# Altium schematic sheet Power.SchDoc
size A; SheetNumber: 2; SheetTotal: 4
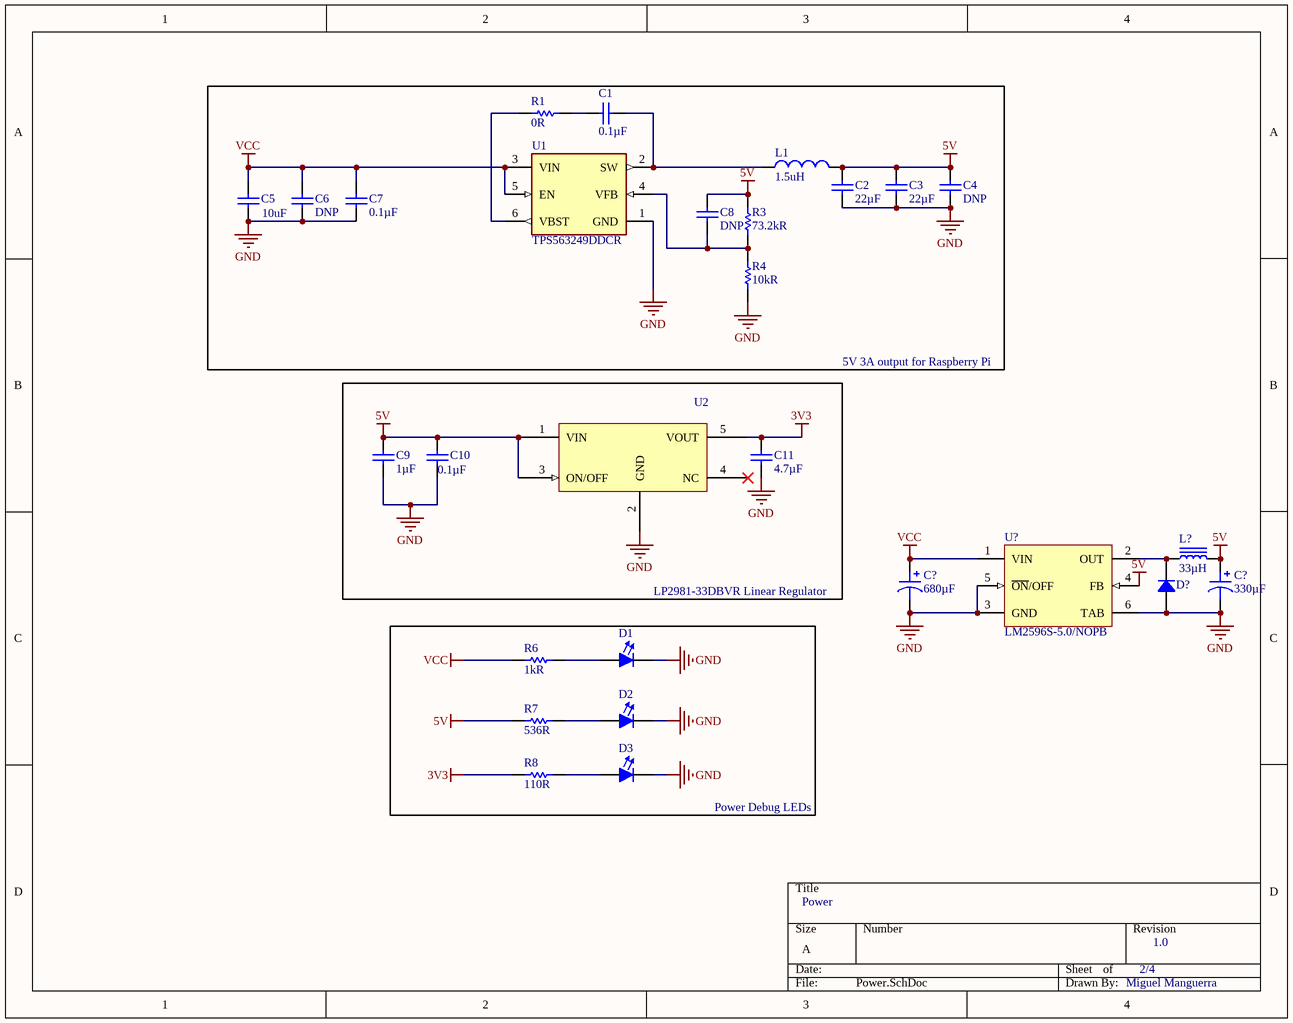
[diagram p0: Power.SchDoc]

## Parts
(Parts that share a designator on the sheet are numbered #1, #2 ... from top to bottom, then left to right.)
C1  Capacitance: 0.1µF  [CAPC1608N(0603")]  (hidden comment: 0.1uF, 50V, 10%, X7R, 0603)
C2  value 22µF  [CAPC2012N(0805")]  (hidden comment: 22uF 35V 0805 SMD, Ceramic)
C3  value 22µF  [CAPC2012N(0805")]  (hidden comment: 22uF 35V 0805 SMD, Ceramic)
C4  value DNP  [CAPC1608N(0603")]  (hidden comment: Placeholder_Capacitor_0603)
C5  Capacitance: 10uF  [CAPC2013X12N]  (hidden comment: 10uF, 25V, X5R, 0805)
C6  value DNP  [CAPC3216N(1206")]  (hidden comment: Placeholder_Capacitor_1206)
C7  Capacitance: 0.1µF  [CAPC1608N(0603")]  (hidden comment: 0.1uF, 50V, 10%, X7R, 0603)
C8  value DNP  [CAPC1608N(0603")]  (hidden comment: Placeholder_Capacitor_0603)
C9  value 1µF  [CAPC1608N(0603")]  (hidden comment: 1uF 25V 0603 SMD, Ceramic)
C10  value 0.1µF  [CAPC1608N(0603")]  (hidden comment: 0.1uF 16V 0603 SMD, Ceramic)
C11  value 4.7µF  [CAPC1608N(0603")]  (hidden comment: 4.7uF 10V 0603 SMD, Ceramic)
C?#1  680µF  [CAP ALSMD 8.3MM H10.5MM]
C?#2  330µF  [CAP ALSMD 8.3MM H10.5MM]
D1  LT Q39G-Q1OO-25-1  [FP-LB_Q39E-MFG]  (value not drawn)
D2  LT Q39G-Q1OO-25-1  [FP-LB_Q39E-MFG]  (value not drawn)
D3  LT Q39G-Q1OO-25-1  [FP-LB_Q39E-MFG]  (value not drawn)
D?  MBRS360BT3G  [DO214AA SMB]  (value not drawn)
L1  Inductance: 1.5uH  [INDC2520X12N]  (hidden comment: DFE252012P-1R5M=P2)
L?  33µH  [BOURNS SRR1280]
R1  value 0R  [RESC1608N(0603")]  (hidden comment: 0R, 1%, 1/10W, 0603 SMD)
R3  Resistance: 73.2kR  [RESC1608X55X30LL15T15]  (hidden comment: ERJ-3EKF7322V)
R4  Resistance: 10kR  [RESC1608X55X25ML10T15]  (hidden comment: RC0603FR-0710KL)
R6  Resistance: 1kR  [RESC1608X55X30ML15T15]  (hidden comment: ERJ3EKF1001V)
R7  536R  [RESC1608X55X30ML15T15]
R8  110R  [RESC1608X55X25ML10T15]
U1  TPS563249DDCR  [FP-DDC0005A-IPC_B]
U2  LP2981-33DBVR  [SOT95P280X145-5N]  (value not drawn)
U?  LM2596S-5.0/NOPB  [KTT0005B_M]

## Blocks framed on the sheet
5V 3A output for Raspberry Pi: C1-C8 L1 R1 R3 R4 U1

## Nets
3V3: C11.2(Cathode) R8.1 U2.5(VOUT)
5V: C2.2(Cathode) C3.2(Cathode) C4.2(Cathode) C8.2(Cathode) C9.2(Cathode) C10.2(Cathode) C?#2.1 L1.2 L?.2 R3.2 R7.1 U2.1(VIN) U2.3(ON/OFF) U?.4(FB)
GND: C2.1(Anode) C3.1(Anode) C4.1(Anode) C5.2 C6.1(Anode) C7.1(Anode) C9.1(Anode) C10.1(Anode) C11.1(Anode) C?#1.2 C?#2.2 D1.1(Cathode) D2.1(Cathode) D3.1(Cathode) D?.1 R4.1 U1.1(GND) U2.2(GND) U?.3(GND) U?.5(~{ON}/OFF) U?.6(TAB)
VCC: C5.1 C6.2(Cathode) C7.2(Cathode) C?#1.1 R6.1 U1.3(VIN) U1.5(EN) U?.1(VIN)
NetC1_1: C1.1(Anode) L1.1 U1.2(SW)
NetC1_2: C1.2(Cathode) R1.2
NetC8_1: C8.1(Anode) R3.1 R4.2 U1.4(VFB)
NetD1_2: D1.2(Anode) R6.2
NetD2_2: D2.2(Anode) R7.2
NetD3_2: D3.2(Anode) R8.2
NetD?_2: D?.2 L?.1 U?.2(OUT)
NetR1_1: R1.1 U1.6(VBST)

Not connected (* = marked no-connect by the designer): U2 4(NC)*

## Notes on the sheet
- LP2981-33DBVR Linear Regulator
- Power Debug LEDs
- Power
- 2/4
- 1.0
- Miguel Manguerra

## Library data of the parts
C1 C7 = CMP-006-0007-1: 0.1µF ±10% Ceramic Capacitor X7R 0603 (1608 Metric); Operating Temperature: -55°C ~ 125°C; Pin Count: 2; Design Item ID: 0.1uF, 50V, 10%, X7R, 0603; Package / Case: 0603 (1608 Metric); Source: AUVic_Schematic_Library_Capacitors.SchLib; ComponentLink1URL: https://www.digikey.ca/product-detail/en/tdk-corporation/C1608X7R1H104M080AA/445-5098-1-ND/2093713; ComponentLink1Description: Digi-Key; Mounting Type: Surface Mount, MLCC; Component Type: Standard; Created By: Poorna Chander Kalidas
C2 C3 = CMP-006-0036-1: Capacitor, Ceramic, 35V, +/- 20%, 0805 SMD, X5R; Design Item ID: 22uF 35V 0805 SMD, Ceramic; Source: AUVic_Schematic_Library_Capacitors.SchLib; Pin Count: 2; Component Type: Standard; Publisher: AUVic; PackageDescription: Chip Capacitor; Published: 14-06-01
C4 C8 = CMP-006-0054-1: Placeholder 0603 SMT Footprint; Made By: Ashwin Sira; Date Created: 2016-06-26; Design Item ID: Placeholder_Capacitor_0603; PackageDescription: Chip Capacitor; Component Type: Standard (No BOM); Pin Count: 2; Source: AUVic_Schematic_Library_Capacitors.SchLib; Publisher: AUVic
C5 = CMP-00114-1: 0805 10 uF 25 V ±10% Tolerance X5R SMT Multilayer Ceramic Capacitor; Dielectric: X7R; Max Operating Temperature: 85°C; Resistor Type: Ceramic; Lead Free: Lead Free; Tolerance: 10%; Height: 1.25mm; Package Quantity: 1; Voltage Rating: 25V; Width: 0.049inch; Min Operating Temperature: -55°C; Case Code (Imperial): 0805; Number of Pins: 2; Thickness: 0.053inch; Length: 0.079inch; Case Code (Metric): 2012; Mount: Surface Mount; Case/Package: 0805; Packaging: Tape and Reel; REACH SVHC: No SVHC; Termination: SMD/SMT; Voltage Rating (DC): 25V
C6 = CMP-006-0056-1: Placeholder 1206 SMT Footprint; Made By: Ashwin Sira; PackageDescription: Chip Capacitor; Component Type: Standard (No BOM); Source: AUVic_Schematic_Library_Capacitors.SchLib; Date Created: 2016-06-26; Design Item ID: Placeholder_Capacitor_1206; Pin Count: 2; Publisher: AUVic
C9 = CMP-006-0027-1: Capacitor, Ceramic, 25V, +/- 10%, 0603 SMD, X5R; MFG: Murata-Electronics-North-America; MFG#: GRM188R61E105KA12D; Created By: Andy Bates; Publisher: AUVic; Source: AUVic_Schematic_Library_Capacitors.SchLib; Component Type: Standard; Pin Count: 2; PackageDescription: Chip Capacitor; Design Item ID: 1uF 25V 0603 SMD, Ceramic; Published: 16-06-27
C10 = CMP-006-0005-1: Capacitor, Ceramic, 16V, +/- 10%, 0603 SMD, X7R; Created By: Andy Bates; Published: 16-04-26; PackageDescription: Chip Capacitor; Pin Count: 2; Source: AUVic_Schematic_Library_Capacitors.SchLib; Design Item ID: 0.1uF 16V 0603 SMD, Ceramic; Component Type: Standard; Publisher: AUVic
C11 = CMP-006-0043-1: Capacitor, Ceramic, 10V, +/- 10%, 0603 SMD, X5R; MFG: Samsung; MFG#: GRM188R61A475KE15D; PackageDescription: Chip Capacitor; Source: AUVic_Schematic_Library_Capacitors.SchLib; Published: 16-06-23; Created By: Ashwin Sira; Component Type: Standard; Pin Count: 2; Publisher: AUVic; Design Item ID: 4.7uF 10V 0603 SMD, Ceramic
C?#1 = EMZR160ARA681MHA0G: CAP ALUM 680UF 20% 16V SMD; Manufacturer: United Chemi-Con; ESR (Equivalent Series Resistance): 80mOhm @ 100kHz; Lifetime @ Temp.: 2000 Hrs @ 105°C; Polarization: Polar; Ripple Current @ High Frequency: 850mA @ 100kHz; Ripple Current @ Low Frequency: 510mA @ 120Hz; Surface Mount Land Size: 0.327" L x 0.327" W (8.30mm x 8.30mm); Part Number: EMZR160ARA681MHA0G; Applications: Automotive; Capacitance: 680µF; ComponentLink1Description: Datasheet; ComponentLink1URL: http://www.chemi-con.co.jp/cgi-bin/CAT_DB/SEARCH/cat_db_al.cgi?e=e&j=p&pdfname=mzr; ComponentLink2Description: DigiKey Link; ComponentLink2URL: http://digikey.com/product-detail/en/united-chemi-con/EMZR160ARA681MHA0G/565-5139-1-ND/8637134; Device Package: Radial, Can - SMD; Height - Seated (Max): 0.413" (10.50mm); LastUpdated: 9/2/2020 1:25:13 AM; Lifecycle Status: Active; Minimum Order: 1; Mounting Type: Surface Mount; Operating Temperature: -55°C ~ 105°C; Package / Case: Radial, Can - SMD; Packaging: TapeAndReel; PartId: 7809; Part Status: Active; Price: 0.33; Ratings: AEC-Q200; Series: Alchip™- MZR; Size / Dimension: 0.315" Dia (8.00mm); Supplier 1: DigiKey; Supplier Part Number 1: 565-5139-1-ND; Tolerance: ±20%; Value: 680µF; Voltage - Rated: 16V
C?#2 = UUR1E331MNL6GS: CAP ALUM 330UF 20% 25V SMD; Manufacturer: Nichicon; Lifetime @ Temp.: 2000 Hrs @ 85°C; Ripple Current @ High Frequency: 369.2mA @ 10kHz; Ripple Current @ Low Frequency: 284mA @ 120Hz; Surface Mount Land Size: 0.327" L x 0.327" W (8.30mm x 8.30mm); Part Number: UUR1E331MNL6GS; Applications: General Purpose; Capacitance: 330µF; ComponentLink1Description: Datasheet; ComponentLink1URL: http://nichicon-us.com/english/products/pdfs/e-uur.pdf; ComponentLink2Description: DigiKey Link; ComponentLink2URL: http://digikey.com/product-detail/en/nichicon/UUR1E331MNL6GS/493-6224-1-ND/3438737; Device Package: Radial, Can - SMD; Height - Seated (Max): 0.413" (10.50mm); LastUpdated: 9/2/2020 1:25:16 AM; Lifecycle Status: Active; Minimum Order: 1; Mounting Type: Surface Mount; Operating Temperature: -40°C ~ 85°C; Package / Case: Radial, Can - SMD; Packaging: TapeAndReel; PartId: 7472; Part Status: Active; Price: 0.22; Series: UUR; Size / Dimension: 0.315" Dia (8.00mm); Supplier 1: DigiKey; Supplier Part Number 1: 493-6224-1-ND; Tolerance: ±20%; Value: 330µF; Voltage - Rated: 25V
D1-D3 = CMP-00064-3: LED GREEN DIFFUSED 0603 SMD; Dominant Wavelength: 530nm; Luminous Intensity: 280mcd; Lens Style: Diffused,Colorless,Rectangular; Number of LEDs: 1; Forward Voltage: 2.85V; Test Current: 5mA; Reverse Voltage: 5V; Forward Current: 15mA; Luminous Flux: 0.55lm; Radiation Hardening: No; Packaging: Tape and Reel; Mount: Surface Mount; Color: Green; Max Operating Temperature: 85°C; Number of Elements: 1; Number of Pins: 2; Min Operating Temperature: -40°C; Depth: 0.9mm; Case/Package: SMD/SMT; Length: 1.7mm
D? = MBRS360BT3G: DIODE SCHOTTKY 60V 3A SMB; Manufacturer: ON Semiconductor; Current - Reverse Leakage @ Vr: 30µA @ 60V; Speed: Fast Recovery =< 500ns, > 200mA (Io); Voltage - Forward (Vf) (Max) @ If: 630mV @ 3A; Part Number: MBRS360BT3G; ComponentLink1Description: Datasheet; ComponentLink1URL: https://www.onsemi.com/pub/Collateral/MBRS360T3-D.PDF; ComponentLink2Description: DigiKey Link; ComponentLink2URL: http://digikey.com/product-detail/en/on-semiconductor/MBRS360BT3G/MBRS360BT3GOSCT-ND/2623453; Current - Average Rectified (Io): 3A; Diode Type: Schottky; LastUpdated: 9/2/2020 1:18:52 AM; Lifecycle Status: Active; Minimum Order: 1; Mounting Type: Surface Mount; Operating Temperature - Junction: -65°C ~ 175°C; Package / Case: DO-214AA, SMB; Packaging: TapeAndReel; PartId: 1547; Part Status: Active; Price: 0.13; Series: -; Supplier 1: DigiKey; Supplier Part Number 1: MBRS360BT3GOSCT-ND; Supplier Device Package: SMB; Voltage - DC Reverse (Vr) (Max): 60V
L1 = CMP-00112-1: Ind Metal Alloy Shielded 1.5uH 20% 1MHz Powdered Iron 2.6A 1008 T/R; Core Material: Ferrite; Current Rating: 3.5A; DC Resistance (DCR): 60mR; Packaging: Tape and Reel; Mount: Surface Mount; Depth: 2mm; Tolerance: 20%; Shielding: Shielded; Test Frequency: 1MHz; Width: 0.079inch; Case Code (Metric): 2520; Min Operating Temperature: -40°C; Resistor Type: Wirewound,Metal Alloy; Length: 0.098inch; Case/Package: 1008; Case Code (Imperial): 1008; Height - Seated (Max): 0.039inch; Max Operating Temperature: 125°C; Max DC Current: 2.6A
L? = SRR1280-330M: FIXED IND 33UH 3.5A 57 MOHM SMD; Manufacturer: Bourns Inc.; Current - Saturation: 3.3A; DC Resistance (DCR): 57mOhm Max; Frequency - Self Resonant: 9.5MHz; Inductance Frequency - Test: 100kHz; Material - Core: Ferrite; Q @ Freq: 28 @ 2.52MHz; Shielding: Shielded; Tolerance: ±20%; Type: Wirewound; Part Number: SRR1280-330M; ComponentLink1Description: Datasheet; ComponentLink1URL: https://www.bourns.com/docs/Product-Datasheets/SRR1280.pdf; ComponentLink2Description: DigiKey Link; ComponentLink2URL: http://digikey.com/product-detail/en/bourns-inc/SRR1280-330M/SRR1280-330MCT-ND/2127440; Current Rating (Amps): 3.5A; Device Package: Nonstandard; Height - Seated (Max): 0.315" (8.00mm); Inductance: 33µH; LastUpdated: 9/2/2020 1:22:09 AM; Lifecycle Status: Active; Minimum Order: 1; Mounting Type: Surface Mount; Operating Temperature: -40°C ~ 125°C; Package / Case: Nonstandard; Packaging: TapeAndReel; PartId: 25; Part Status: Active; Price: 0.65; Series: SRR1280; Size / Dimension: 0.492" L x 0.492" W (12.50mm x 12.50mm); Supplier 1: DigiKey; Supplier Part Number 1: SRR1280-330MCT-ND; Value: 33µH
R1 = CMP-047-0001-1: Made By: Ashwin Sira; Owned By: AUVic; Component Type: Standard; Design Item ID: 0R, 1%, 1/10W, 0603 SMD; Last Edited: 14-05-31; Created On: 14-05-31; Source: AUVic_Schematic_Library_Resistors.SchLib; Pin Count: 2
R3 = CMP-00029-1: Res Thick Film 0603 73.2K Ohm 1% 0.1W(1/10W) ±100ppm/C Pad SMD Automotive T/R; Max Power Dissipation: 100mW; Voltage Rating (DC): 50V; Temperature Coefficient: 100ppm/°C; Voltage Rating: 75V; Packaging: Tape and Reel; REACH SVHC: No SVHC; Case Code (Imperial): 0603; Mount: Surface Mount; Height: 0.022inch; Military Standard: Not; Features: Automotive AEC-Q200; Power Rating: 100mW; Width: 0.031inch; Termination: SMD/SMT; Number of Terminations: 2; Composition: Thick Film; Length: 1.6mm; Depth: 0.8mm; Min Operating Temperature: -55°C; Package Quantity: 1; Max Operating Temperature: 155°C; Case/Package: 0603; Case Code (Metric): 1608; Tolerance: 1%; Radiation Hardening: No; Contact Plating: Tin; Lead Free: Lead Free
R4 = CMP-00037-1: Res General Purpose Thick Film 0603 10K Ohm 1% 1/10W ±100ppm/°C Molded SMD Paper T/R; Power Rating: 100mW; Voltage Rating (DC): 50V; Voltage Rating: 75V; Case/Package: 0603; Weight: 7.1E-05oz; Case Code (Imperial): 0603; Composition: Thick Film; Depth: 0.8mm; Min Operating Temperature: -55°C; Width: 0.8mm; Height: 0.45mm; Military Standard: Not; Packaging: Tape and Reel; Termination: SMD/SMT; Lead Free: Lead Free; Temperature Coefficient: 100ppm/°C; Number of Pins: 2; Max Operating Temperature: 155°C; Lead Pitch: 0.3mm; REACH SVHC: No SVHC; Case Code (Metric): 1608; Tolerance: 1%; Length: 1.6mm
R6 = CMP-00062-2: Res Thick Film 0603 1K Ohm 1% 1/10W ±100ppm/°C Molded SMD Punched Carrier T/R; Voltage Rating (DC): 75V; Max Power Dissipation: 100mW; Package Quantity: 5000; Composition: Thick Film; Min Operating Temperature: -55°C; Case Code (Metric): 1608; Case/Package: 0603; Lead Free: Lead Free; Packaging: Tape and Reel; Case Code (Imperial): 0603; Width: 0.8mm; Military Standard: Not; Contact Plating: Tin; Length: 1.6mm; Max Operating Temperature: 155°C; Height: 0.45mm; Temperature Coefficient: 100ppm/°C; Depth: 0.8mm; Voltage Rating: 75V; Tolerance: 1%; Features: Automotive AEC-Q200; Mount: Surface Mount; REACH SVHC: No SVHC; Power Rating: 100mW; Radiation Hardening: No; Number of Terminations: 2; Number of Pins: 2; Termination: SMD/SMT
R7 = CMP-00071-2: SMD Chip Resistor, 0603 [1608 Metric], 536 ohm, ERJ3EK Series, 75 V, Thick Film, 100 mW; Tolerance: 1%; Voltage Rating (DC): 50V; Voltage Rating: 75V; Power Rating: 100mW; Temperature Coefficient: 100ppm/°C; Max Operating Temperature: 155°C; Package Quantity: 1; REACH SVHC: No SVHC; Depth: 0.8mm; Composition: Thick Film; Height: 0.022inch; Packaging: Tape and Reel; Contact Plating: Tin; Lead Free: Lead Free; Length: 1.6mm; Case/Package: 0603; Military Standard: Not; Features: Automotive AEC-Q200; Resistance: 536R; Termination: SMD/SMT; Max Power Dissipation: 100mW; Width: 0.8mm; Mount: Surface Mount; Case Code (Metric): 1608; Case Code (Imperial): 0603; Number of Terminations: 2; Min Operating Temperature: -55°C
R8 = CMP-00069-2: RES SMD 110 OHM 1% 1/10W 0603; Max Power Dissipation: 100mW; Voltage Rating (DC): 50V; Temperature Coefficient: 100ppm/°C; Working Voltage: 75V; Military Standard: Not; Termination: SMD/SMT; Number of Terminations: 2; Features: Moisture Resistant; Min Operating Temperature: -55°C; Power Rating: 100mW; Height: 0.022inch; Package Quantity: 1; Lead Free: Lead Free; Tolerance: 1%; Voltage Rating: 50V; Resistance: 110R; Composition: Thick Film; Case Code (Imperial): 0603; Length: 1.6mm; Packaging: Tape and Reel; Case Code (Metric): 1608; Max Operating Temperature: 155°C; Depth: 0.8mm; Case/Package: 0603; Width: 0.031inch
U1 = CMP-044-0004-1: 17-V, 3-A, constant 1.4-MHz synchronous step-down voltage regulator 6-SOT-23-THIN -40 to 125
U2 = CMP-044-0003-2: IC REG LINEAR 3.3V 100MA SOT23-5; Max Input Voltage: 16V; Min Input Voltage: 2.2V; Number of Regulators: 1; Output Voltage Accuracy: 2%; Polarity: Positive; Input Bias Current: 600uA; Output Type: Fixed; Dropout Voltage: 200mV; Package Quantity: 1; REACH SVHC: No SVHC; Output Voltage: 3.3V; Min Operating Temperature: -40°C; Case/Package: SOT-23; Max Output Current: 100mA; Lead Free: Lead Free; Max Operating Temperature: 125°C; Number of Outputs: 1; Number of Pins: 5; Mount: Surface Mount; Accuracy: 2%; Nominal Output Voltage: 3.3V; Output Current: 100mA; Packaging: Tape and Reel; Quiescent Current: 600uA; Radiation Hardening: No; Contact Plating: Tin,Matte
U? = CMP-0069-00269-3: SIMPLE SWITCHER® Power Converter 150 KHz 3A Step-Down Voltage Regulator, 5-pin TO-263, Pb-Free; Manufacturer: Texas Instruments; PowerWise: N; PackageTopMarking: NSUZXYTTE#*LM2596S*-5.0 P+; ComponentLink1URL: http://www.ti.com/general/docs/lit/getliterature.tsp?genericPartNumber=LM2596&fileType=pdf; PackageDescription: TO-263, Molded, .400 x .390 x .180in, 5 Lead, .067in Pitch, Surface Mount; RoHS: Y; PinCount: 5; Code_JEDEC: MO-169-AB; ComponentLink1Description: Datasheet URL; PackageReference: KTT0005B; CompType: Switcher